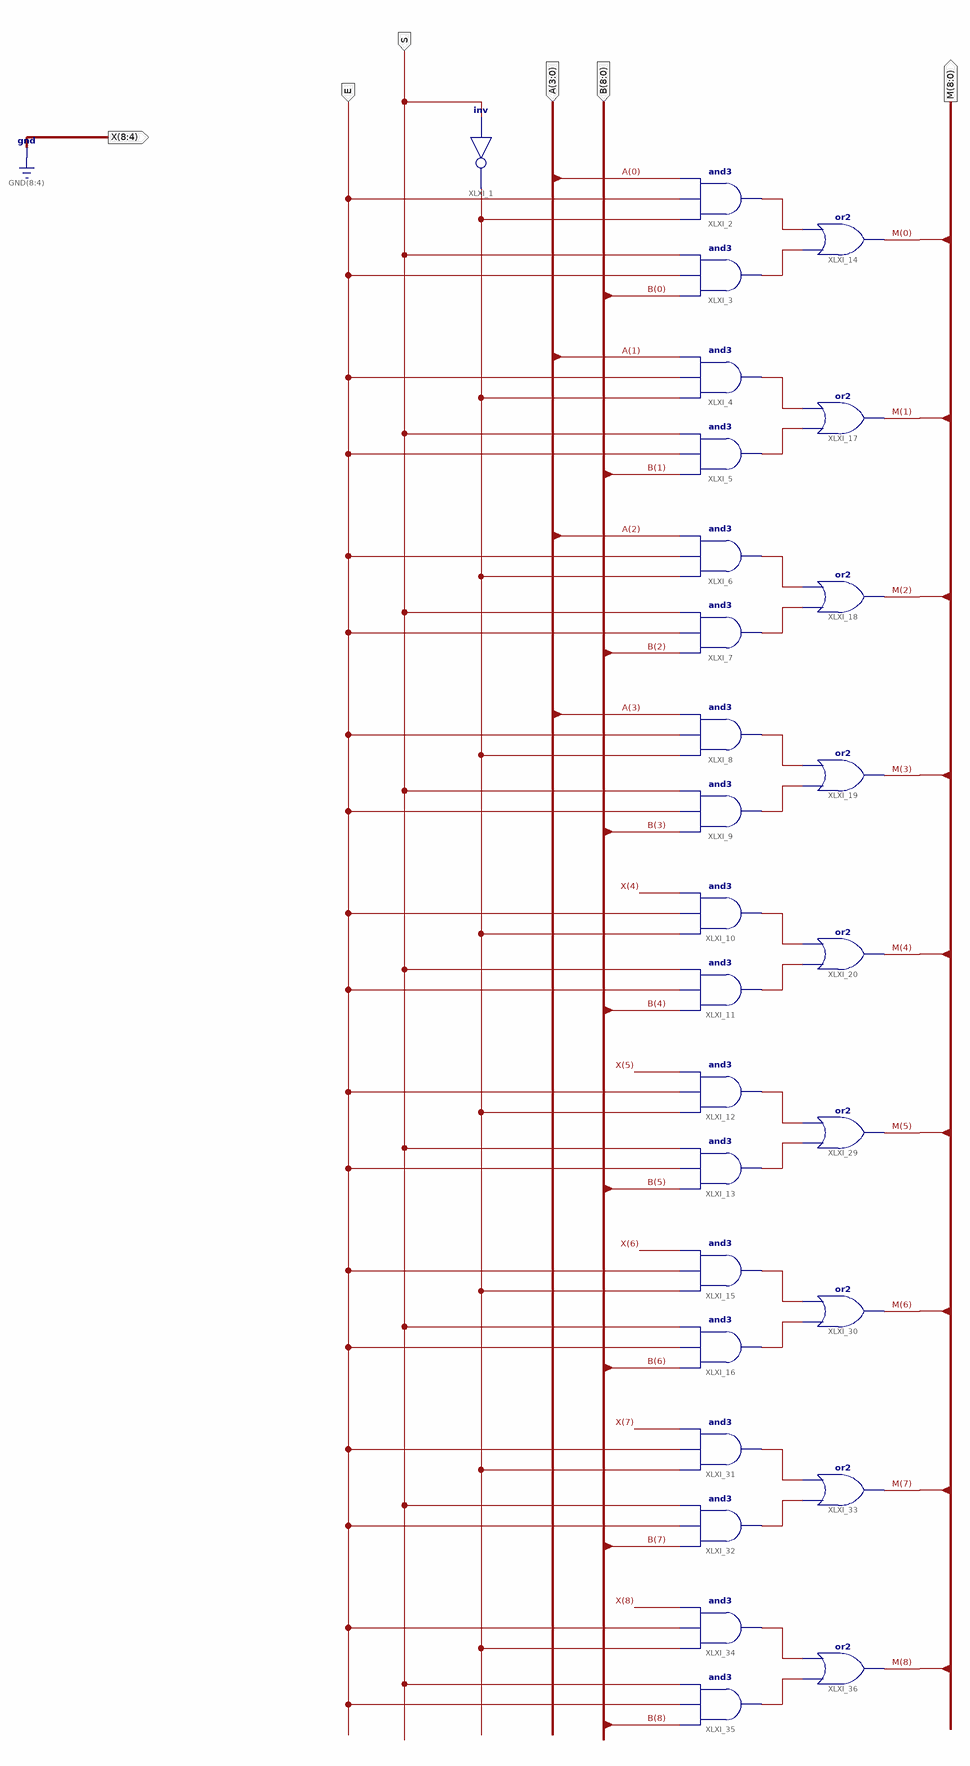
[diagram p0: schematic sheet 1]
// Xilinx ISE schematic TwotoOne8BitMux.sch (artix7) as structural Verilog: 28 symbols, 6 ports
module TwotoOne8BitMux (
  input  [3:0] A,
  input  [8:0] B,
  input  E,
  input  S,
  output [8:0] M,
  output [8:4] X
);

  wire XLXN_3, XLXN_5, XLXN_6, XLXN_16, XLXN_17, XLXN_18, XLXN_19, XLXN_41, XLXN_42, XLXN_43, XLXN_44,
       XLXN_45, XLXN_46, XLXN_47, XLXN_48, XLXN_49, XLXN_50, XLXN_72, XLXN_73;

  not XLXI_1 (XLXN_3, S);
  and XLXI_2 (XLXN_5, XLXN_3, E, A[0]);
  and XLXI_3 (XLXN_6, B[0], E, S);
  and XLXI_4 (XLXN_16, XLXN_3, E, A[1]);
  and XLXI_5 (XLXN_17, B[1], E, S);
  and XLXI_6 (XLXN_18, XLXN_3, E, A[2]);
  and XLXI_7 (XLXN_19, B[2], E, S);
  and XLXI_8 (XLXN_41, XLXN_3, E, A[3]);
  and XLXI_9 (XLXN_42, B[3], E, S);
  and XLXI_10 (XLXN_43, XLXN_3, E, 1'b0);
  and XLXI_11 (XLXN_44, B[4], E, S);
  and XLXI_12 (XLXN_45, XLXN_3, E, 1'b0);
  and XLXI_13 (XLXN_46, B[5], E, S);
  or XLXI_14 (M[0], XLXN_6, XLXN_5);
  and XLXI_15 (XLXN_47, XLXN_3, E, 1'b0);
  and XLXI_16 (XLXN_48, B[6], E, S);
  or XLXI_17 (M[1], XLXN_17, XLXN_16);
  or XLXI_18 (M[2], XLXN_19, XLXN_18);
  or XLXI_19 (M[3], XLXN_42, XLXN_41);
  or XLXI_20 (M[4], XLXN_44, XLXN_43);
  or XLXI_29 (M[5], XLXN_46, XLXN_45);
  or XLXI_30 (M[6], XLXN_48, XLXN_47);
  and XLXI_31 (XLXN_49, XLXN_3, E, 1'b0);
  and XLXI_32 (XLXN_50, B[7], E, S);
  or XLXI_33 (M[7], XLXN_50, XLXN_49);
  and XLXI_34 (XLXN_72, XLXN_3, E, 1'b0);
  and XLXI_35 (XLXN_73, B[8], E, S);
  or XLXI_36 (M[8], XLXN_73, XLXN_72);

  assign X = {5{1'b0}};
endmodule
